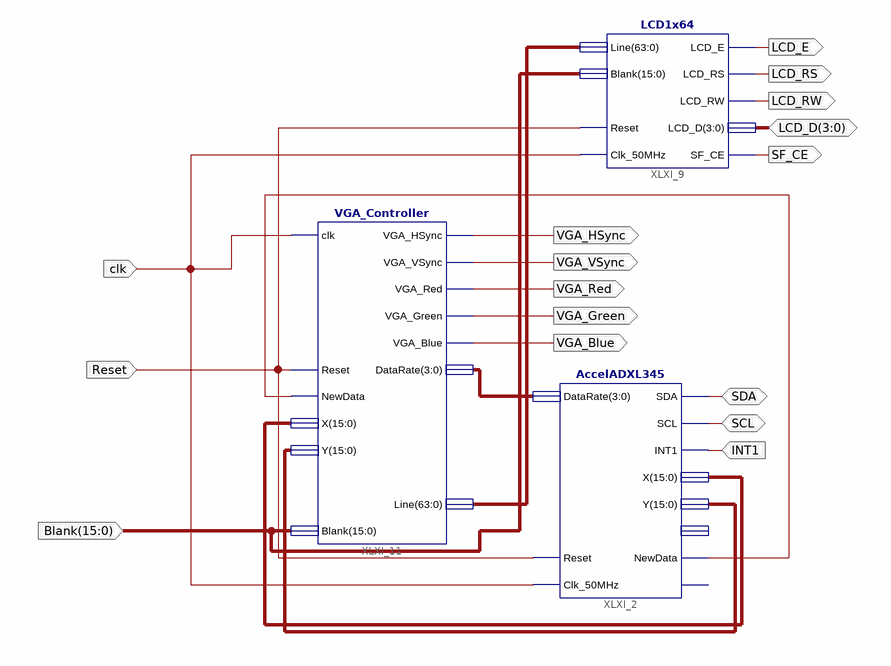
[diagram p0: schematic sheet 1]
// Xilinx ISE schematic schemat.sch (spartan3e) as structural Verilog: 3 symbols, 16 ports
module schemat (
  input  clk,
  input  INT1,
  input  Reset,
  input  [15:0] Blank,
  inout  SDA,
  inout  SCL,
  inout  [3:0] LCD_D,
  output LCD_E,
  output LCD_RS,
  output LCD_RW,
  output SF_CE,
  output VGA_HSync,
  output VGA_VSync,
  output VGA_Red,
  output VGA_Green,
  output VGA_Blue
);

  wire XLXN_25;
  wire [3:0] XLXN_38;
  wire [15:0] XLXN_22, XLXN_23;
  wire [63:0] XLXN_33;

  LCD1x64 XLXI_9 (
    .Clk_50MHz(clk), .Reset(Reset), .Line(XLXN_33), .Blank(Blank), .LCD_D(LCD_D), .LCD_E(LCD_E),
    .LCD_RW(LCD_RW), .LCD_RS(LCD_RS), .SF_CE(SF_CE));
  AccelADXL345 XLXI_2 (
    .SDA(SDA), .SCL(SCL), .INT1(INT1), .X(XLXN_22), .Y(XLXN_23), .NewData(XLXN_25), .Clk_50MHz(clk),
    .Reset(Reset), .DataRate(XLXN_38));  // open: Z, I2C_NACK
  VGA_Controller XLXI_11 (
    .clk(clk), .NewData(XLXN_25), .Reset(Reset), .X(XLXN_22), .Y(XLXN_23), .VGA_HSync(VGA_HSync),
    .VGA_VSync(VGA_VSync), .VGA_Red(VGA_Red), .VGA_Green(VGA_Green), .VGA_Blue(VGA_Blue), .DataRate(XLXN_38),
    .Line(XLXN_33), .Blank(Blank));
endmodule
